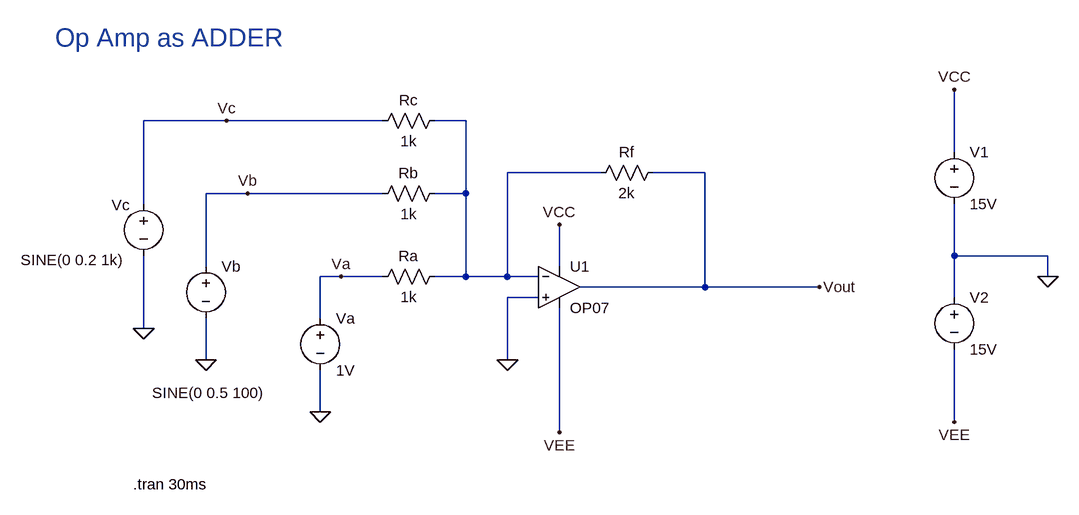
[diagram p0: schematic Op_Amp_Adder.asc]
Op_Amp_Adder.asc, the LTspice schematic file:
Version 4
SHEET 1 1396 792
WIRE 112 16 -16 16
WIRE 352 16 112 16
WIRE 480 16 432 16
WIRE 1232 64 1232 -32
WIRE 688 96 544 96
WIRE 848 96 768 96
WIRE 144 128 80 128
WIRE 352 128 144 128
WIRE 480 128 480 16
WIRE 480 128 432 128
WIRE -16 144 -16 16
WIRE 1232 224 1232 144
WIRE 1376 224 1232 224
WIRE 80 240 80 128
WIRE 624 240 624 176
WIRE 288 256 256 256
WIRE 352 256 288 256
WIRE 480 256 480 128
WIRE 480 256 432 256
WIRE 544 256 544 96
WIRE 544 256 480 256
WIRE 592 256 544 256
WIRE 1376 256 1376 224
WIRE 848 272 848 96
WIRE 848 272 656 272
WIRE 1024 272 848 272
WIRE 592 288 544 288
WIRE 1232 288 1232 224
WIRE 256 320 256 256
WIRE -16 336 -16 224
WIRE 80 384 80 320
WIRE 544 384 544 288
WIRE 256 464 256 400
WIRE 1232 480 1232 368
WIRE 624 496 624 304
FLAG 1024 272 Vout
FLAG 544 384 0
FLAG 256 464 0
FLAG 80 384 0
FLAG -16 336 0
FLAG 1376 256 0
FLAG 1232 480 VEE
FLAG 1232 -32 VCC
FLAG 624 496 VEE
FLAG 624 176 VCC
FLAG 112 16 Vc
FLAG 144 128 Vb
FLAG 288 256 Va
SYMBOL OpAmps\\OP07 624 208 R0
SYMATTR InstName U1
SYMBOL res 784 80 R90
WINDOW 0 0 56 VBottom 2
WINDOW 3 32 56 VTop 2
SYMATTR InstName Rf
SYMATTR Value 2k
SYMBOL res 448 0 R90
WINDOW 0 0 56 VBottom 2
WINDOW 3 32 56 VTop 2
SYMATTR InstName Rc
SYMATTR Value 1k
SYMBOL res 448 112 R90
WINDOW 0 0 56 VBottom 2
WINDOW 3 32 56 VTop 2
SYMATTR InstName Rb
SYMATTR Value 1k
SYMBOL res 448 240 R90
WINDOW 0 0 56 VBottom 2
WINDOW 3 32 56 VTop 2
SYMATTR InstName Ra
SYMATTR Value 1k
SYMBOL voltage 256 304 R0
WINDOW 123 0 0 Left 0
WINDOW 39 0 0 Left 0
SYMATTR InstName Va
SYMATTR Value 1V
SYMBOL voltage 80 224 R0
WINDOW 123 0 0 Left 0
WINDOW 39 0 0 Left 0
WINDOW 3 -83 211 Left 2
SYMATTR InstName Vb
SYMATTR Value SINE(0 0.5 100)
SYMBOL voltage -16 128 R0
WINDOW 123 0 0 Left 0
WINDOW 39 0 0 Left 0
WINDOW 0 -49 18 Left 2
WINDOW 3 -189 102 Left 2
SYMATTR InstName Vc
SYMATTR Value SINE(0 0.2 1k)
SYMBOL voltage 1232 48 R0
WINDOW 123 0 0 Left 0
WINDOW 39 0 0 Left 0
SYMATTR InstName V1
SYMATTR Value 15V
SYMBOL voltage 1232 272 R0
WINDOW 123 0 0 Left 0
WINDOW 39 0 0 Left 0
SYMATTR InstName V2
SYMATTR Value 15V
TEXT -152 -112 Left 4 ;Op Amp as ADDER
TEXT -32 576 Left 2 !.tran 30ms

The netlist it stands for:
* Op_Amp_Adder.asc
XU1 0 N001 VCC VEE Vout LT1001  ; OP07, pins In+ In- V+ V- OUT
Rf Vout N001 2k
Rc N001 Vc 1k
Rb N001 Vb 1k
Ra N001 Va 1k
Va Va 0 1V
Vb Vb 0 SINE(0 0.5 100)
Vc Vc 0 SINE(0 0.2 1k)
V1 VCC 0 15V
V2 0 VEE 15V
* Op Amp as ADDER
.tran 30ms
.lib LTC.lib
.backanno
.end